# Altium project GatorSynth_Step_Sequencer.PrjPcb (part 2 of 2)

## Sheet Encoders.SchDoc
size Letter
Used 24 times, as channels AUX Encoders, AUX Encoders, AUX Encoders, AUX Encoders, AUX Encoders, AUX Encoders, AUX Encoders, AUX Encoders, NOTE Encoders, NOTE Encoders, NOTE Encoders, NOTE Encoders, NOTE Encoders, NOTE Encoders, NOTE Encoders, NOTE Encoders, NOTE Encoders, NOTE Encoders, NOTE Encoders, NOTE Encoders, NOTE Encoders, NOTE Encoders, NOTE Encoders, NOTE Encoders. Parts and nets are listed once, with the designators drawn on the sheet.
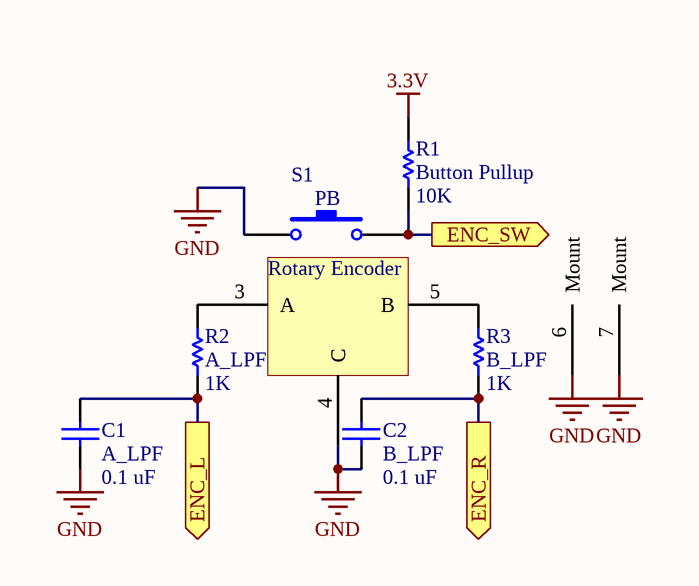
[diagram p10: Encoders.SchDoc]

### Parts
C1  A_LPF  value 0.1 uF  [C0805]
C2  B_LPF  value 0.1 uF  [C0805]
R1  Button Pullup  value 10K  [6-0805_N]
R2  A_LPF  value 1K  [6-0805_N]
R3  B_LPF  value 1K  [6-0805_N]
S1  Rotary Encoder  [Rotary Encoder SF]  (value not drawn)

### Ports
ENC_L (out), ENC_R (out), ENC_SW (out)

### Nets
3.3V: R1.1
GND: C1.1 C2.1 S1.1 S1.4(C) S1.6(Mount) S1.7(Mount)
ENC_L: C1.2 R2.2 ; port ENC_L
ENC_R: C2.2 R3.2 ; port ENC_R
ENC_SW: R1.2 S1.2 ; port ENC_SW
NetR2_1: R2.1 S1.3(A)
NetR3_1: R3.1 S1.5(B)

### Channels
AUX Encoders: designators end in _AUX_Encoders#1; ports ENC_L=AE_L0 ENC_R=AE_R0 ENC_SW=AE_SW0
AUX Encoders: designators end in _AUX_Encoders#2; ports ENC_L=AE_L1 ENC_R=AE_R1 ENC_SW=AE_SW1
AUX Encoders: designators end in _AUX_Encoders#3; ports ENC_L=AE_L2 ENC_R=AE_R2 ENC_SW=AE_SW2
AUX Encoders: designators end in _AUX_Encoders#4; ports ENC_L=AE_L3 ENC_R=AE_R3 ENC_SW=AE_SW3
AUX Encoders: designators end in _AUX_Encoders#5; ports ENC_L=AE_L4 ENC_R=AE_R4 ENC_SW=AE_SW4
AUX Encoders: designators end in _AUX_Encoders#6; ports ENC_L=AE_L5 ENC_R=AE_R5 ENC_SW=AE_SW5
AUX Encoders: designators end in _AUX_Encoders#7; ports ENC_L=AE_L6 ENC_R=AE_R6 ENC_SW=AE_SW6
AUX Encoders: designators end in _AUX_Encoders#8; ports ENC_L=AE_L7 ENC_R=AE_R7 ENC_SW=AE_SW7
NOTE Encoders: designators end in _NOTE_Encoders#1; ports ENC_L=NE_L0 ENC_R=NE_R0 ENC_SW=NE_SW0
NOTE Encoders: designators end in _NOTE_Encoders#2; ports ENC_L=NE_L1 ENC_R=NE_R1 ENC_SW=NE_SW1
NOTE Encoders: designators end in _NOTE_Encoders#3; ports ENC_L=NE_L2 ENC_R=NE_R2 ENC_SW=NE_SW2
NOTE Encoders: designators end in _NOTE_Encoders#4; ports ENC_L=NE_L3 ENC_R=NE_R3 ENC_SW=NE_SW3
NOTE Encoders: designators end in _NOTE_Encoders#5; ports ENC_L=NE_L4 ENC_R=NE_R4 ENC_SW=NE_SW4
NOTE Encoders: designators end in _NOTE_Encoders#6; ports ENC_L=NE_L5 ENC_R=NE_R5 ENC_SW=NE_SW5
NOTE Encoders: designators end in _NOTE_Encoders#7; ports ENC_L=NE_L6 ENC_R=NE_R6 ENC_SW=NE_SW6
NOTE Encoders: designators end in _NOTE_Encoders#8; ports ENC_L=NE_L7 ENC_R=NE_R7 ENC_SW=NE_SW7
NOTE Encoders: designators end in _NOTE_Encoders#9; ports ENC_L=NE_L8 ENC_R=NE_R8 ENC_SW=NE_SW8
NOTE Encoders: designators end in _NOTE_Encoders#10; ports ENC_L=NE_L9 ENC_R=NE_R9 ENC_SW=NE_SW9
NOTE Encoders: designators end in _NOTE_Encoders#11; ports ENC_L=NE_L10 ENC_R=NE_R10 ENC_SW=NE_SW10
NOTE Encoders: designators end in _NOTE_Encoders#12; ports ENC_L=NE_L11 ENC_R=NE_R11 ENC_SW=NE_SW11
NOTE Encoders: designators end in _NOTE_Encoders#13; ports ENC_L=NE_L12 ENC_R=NE_R12 ENC_SW=NE_SW12
NOTE Encoders: designators end in _NOTE_Encoders#14; ports ENC_L=NE_L13 ENC_R=NE_R13 ENC_SW=NE_SW13
NOTE Encoders: designators end in _NOTE_Encoders#15; ports ENC_L=NE_L14 ENC_R=NE_R14 ENC_SW=NE_SW14
NOTE Encoders: designators end in _NOTE_Encoders#16; ports ENC_L=NE_L15 ENC_R=NE_R15 ENC_SW=NE_SW15

### Notes on the sheet
- (in symbol Rotary Encoder) PB

### Library data of the parts
C1 C2 = Cap: Capacitor; Published: 8-Jun-2000; LatestRevisionDate: 17-Jul-2002; LatestRevisionNote: Re-released for DXP Platform.; PackageReference: RAD-0.3; Publisher: Altium Limited; PackageDescription: Radial Cap, Thru-Hole; 2 Leads; 0.3 in Pin Spacing
R1-R3 = Res1: Resistor; Published: 8-Jun-2000; LatestRevisionDate: 17-Jul-2002; LatestRevisionNote: Re-released for DXP Platform.; PackageReference: AXIAL-0.3; Publisher: Altium Limited; PackageDescription: Axial Device, Thru-Hole; 2 Leads; 0.3 in Pin Spacing

## Sheet Displays.SchDoc
size B
Used 8 times, as channels U_Displays, U_Displays, U_Displays, U_Displays, U_Displays, U_Displays, U_Displays, U_Displays. Parts and nets are listed once, with the designators drawn on the sheet.
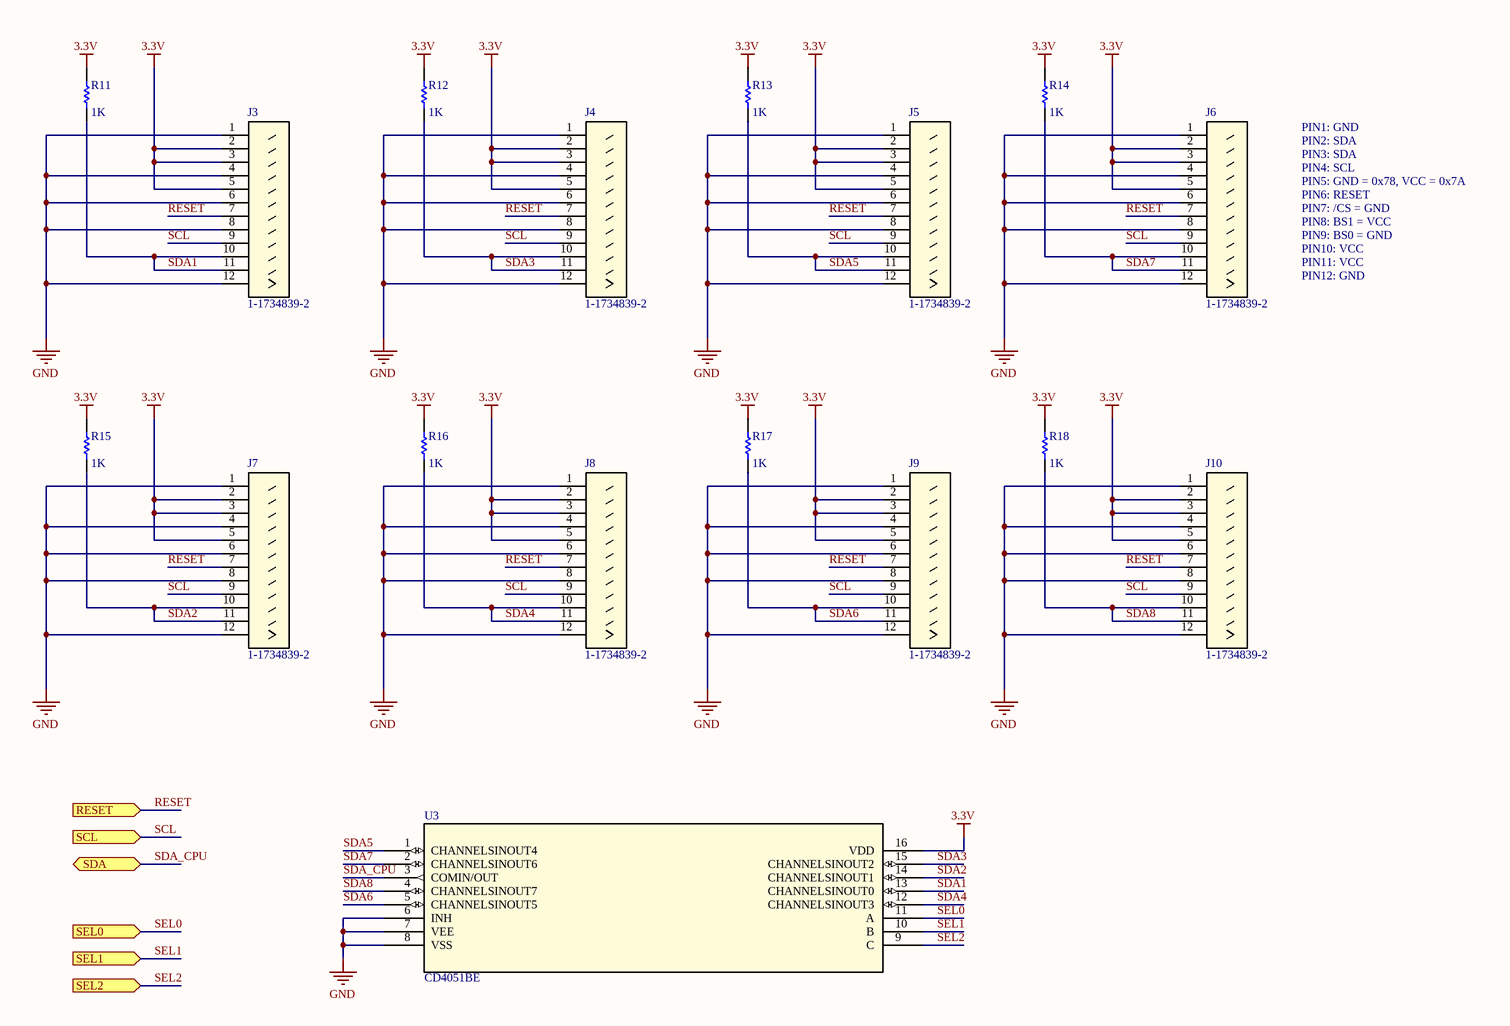
[diagram p11: Displays.SchDoc]

### Parts
J3  1-1734839-2  [CONN_1-1734592-2]
J4  1-1734839-2  [CONN_1-1734592-2]
J5  1-1734839-2  [CONN_1-1734592-2]
J6  1-1734839-2  [CONN_1-1734592-2]
J7  1-1734839-2  [CONN_1-1734592-2]
J8  1-1734839-2  [CONN_1-1734592-2]
J9  1-1734839-2  [CONN_1-1734592-2]
J10  1-1734839-2  [CONN_1-1734592-2]
R11  value 1K  [6-0805_N]
R12  value 1K  [6-0805_N]
R13  value 1K  [6-0805_N]
R14  value 1K  [6-0805_N]
R15  value 1K  [6-0805_N]
R16  value 1K  [6-0805_N]
R17  value 1K  [6-0805_N]
R18  value 1K  [6-0805_N]
U3  CD4051BE  [N16]

### Ports
RESET (in), SCL (in), SDA, SEL0 (in), SEL1 (in), SEL2 (in)

### Nets
3.3V: J3.2 J3.3 J3.5 J4.2 J4.3 J4.5 J5.2 J5.3 J5.5 J6.2 J6.3 J6.5 J7.2 J7.3 J7.5 J8.2 J8.3 J8.5 J9.2 J9.3 J9.5 J10.2 J10.3 J10.5 R11.1 R12.1 R13.1 R14.1 R15.1 R16.1 R17.1 R18.1 U3.16(VDD)
GND: J3.1 J3.4 J3.6 J3.8 J3.12 J4.1 J4.4 J4.6 J4.8 J4.12 J5.1 J5.4 J5.6 J5.8 J5.12 J6.1 J6.4 J6.6 J6.8 J6.12 J7.1 J7.4 J7.6 J7.8 J7.12 J8.1 J8.4 J8.6 J8.8 J8.12 J9.1 J9.4 J9.6 J9.8 J9.12 J10.1 J10.4 J10.6 J10.8 J10.12 U3.6(INH) U3.7(VEE) U3.8(VSS)
RESET: J3.7 J4.7 J5.7 J6.7 J7.7 J8.7 J9.7 J10.7 ; port RESET
SCL: J3.9 J4.9 J5.9 J6.9 J7.9 J8.9 J9.9 J10.9 ; port SCL
SDA1: J3.10 J3.11 R11.2 U3.13(CHANNELSINOUT0)
SDA2: J7.10 J7.11 R15.2 U3.14(CHANNELSINOUT1)
SDA3: J4.10 J4.11 R12.2 U3.15(CHANNELSINOUT2)
SDA4: J8.10 J8.11 R16.2 U3.12(CHANNELSINOUT3)
SDA5: J5.10 J5.11 R13.2 U3.1(CHANNELSINOUT4)
SDA6: J9.10 J9.11 R17.2 U3.5(CHANNELSINOUT5)
SDA7: J6.10 J6.11 R14.2 U3.2(CHANNELSINOUT6)
SDA8: J10.10 J10.11 R18.2 U3.4(CHANNELSINOUT7)
SDA_CPU: U3.3(COMIN/OUT) ; port SDA
SEL0: U3.11(A) ; port SEL0
SEL1: U3.10(B) ; port SEL1
SEL2: U3.9(C) ; port SEL2

### Channels
U_Displays: designators end in _U_Displays#1; ports RESET=DISP_RESET SCL=SCL SDA=SDA_CPU_U_Displays SEL0=SEL0_U_Displays SEL1=SEL1_U_Displays SEL2=SEL2_U_Displays
U_Displays: designators end in _U_Displays#2; ports RESET=DISP_RESET SCL=SCL SDA=SDA_CPU_U_Displays SEL0=SEL0_U_Displays SEL1=SEL1_U_Displays SEL2=SEL2_U_Displays
U_Displays: designators end in _U_Displays#3; ports RESET=DISP_RESET SCL=SCL SDA=SDA_CPU_U_Displays SEL0=SEL0_U_Displays SEL1=SEL1_U_Displays SEL2=SEL2_U_Displays
U_Displays: designators end in _U_Displays#4; ports RESET=DISP_RESET SCL=SCL SDA=SDA_CPU_U_Displays SEL0=SEL0_U_Displays SEL1=SEL1_U_Displays SEL2=SEL2_U_Displays
U_Displays: designators end in _U_Displays#5; ports RESET=DISP_RESET SCL=SCL SDA=SDA_CPU_U_Displays SEL0=SEL0_U_Displays SEL1=SEL1_U_Displays SEL2=SEL2_U_Displays
U_Displays: designators end in _U_Displays#6; ports RESET=DISP_RESET SCL=SCL SDA=SDA_CPU_U_Displays SEL0=SEL0_U_Displays SEL1=SEL1_U_Displays SEL2=SEL2_U_Displays
U_Displays: designators end in _U_Displays#7; ports RESET=DISP_RESET SCL=SCL SDA=SDA_CPU_U_Displays SEL0=SEL0_U_Displays SEL1=SEL1_U_Displays SEL2=SEL2_U_Displays
U_Displays: designators end in _U_Displays#8; ports RESET=DISP_RESET SCL=SCL SDA=SDA_CPU_U_Displays SEL0=SEL0_U_Displays SEL1=SEL1_U_Displays SEL2=SEL2_U_Displays

### Notes on the sheet
- PIN1: GND
- PIN2: SDA
- PIN3: SDA
- PIN4: SCL
- PIN5: GND = 0x78, VCC = 0x7A
- PIN7: /CS = GND
- PIN6: RESET
- PIN8: BS1 = VCC
- PIN9: BS0 = GND
- PIN10: VCC
- PIN11: VCC
- PIN12: GND

### Library data of the parts
J3-J10 = 1-1734839-2: Imported; Manufacturer_Name: Tyco Electronics Amp; Vendor: Tyco Electronics; Supersection: Connectors; Section: General Purpose; C: Copyright (C) 2015 Accelerated Designs. All rights reserved; Manufacturer_Part_Number: 1-1734839-2; Family: Headers and PCB Receptacles; Copyright: Copyright (C) 2015 Accelerated Designs. All rights reserved; RS_Part_Number: 7188674; Value: Value; Type: Type; RefDes: RefDes
R11-R18 = Res1: Resistor; Published: 8-Jun-2000; LatestRevisionDate: 17-Jul-2002; LatestRevisionNote: Re-released for DXP Platform.; PackageReference: AXIAL-0.3; Publisher: Altium Limited; PackageDescription: Axial Device, Thru-Hole; 2 Leads; 0.3 in Pin Spacing
U3 = CD4051BE: Imported; Vendor: Texas Instruments; Section: Switches and Multiplexers; C: Copyright (C) 2015 Accelerated Designs. All rights reserved; Manufacturer_Part_Number: CD4051BE; Family: Analogue Switch Multiplexer; Manufacturer_Name: Texas Instruments; Copyright: Copyright (C) 2015 Accelerated Designs. All rights reserved; RS_Part_Number: 5036098; Value: Value; Type: Type; RefDes: RefDes

## Sheet CV_Control.SchDoc
size Letter
Used 2 times, as channels CV Control, CV Control. Parts and nets are listed once, with the designators drawn on the sheet.
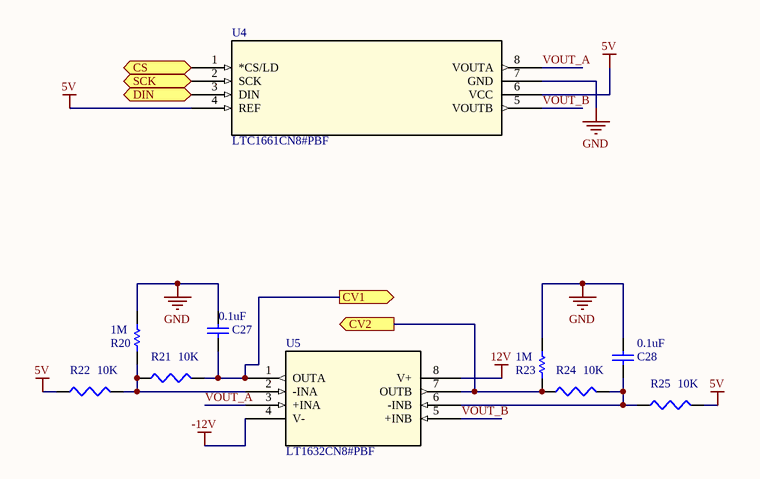
[diagram p12: CV_Control.SchDoc]

### Parts
C27  value 0.1uF  [RAD-0.3]  (hidden comment: Cap)
C28  value 0.1uF  [RAD-0.3]  (hidden comment: Cap)
R20  value 1M  [AXIAL-0.3]  (hidden comment: Res1)
R21  value 10K  [J1-0603]  (hidden comment: Res3)
R22  value 10K  [J1-0603]  (hidden comment: Res3)
R23  value 1M  [AXIAL-0.3]  (hidden comment: Res1)
R24  value 10K  [J1-0603]  (hidden comment: Res3)
R25  value 10K  [J1-0603]  (hidden comment: Res3)
U4  LTC1661CN8#PBF  [PDIP-8_N]
U5  LT1632CN8#PBF  [PDIP-8_N]

### Ports
CS (in), CV1 (out), CV2 (out), DIN, SCK

### Nets
5V: R22.1 R25.2 U4.4(REF) U4.6(VCC)
12V: U5.8(V+)
-12V: U5.4(V-)
GND: C27.2 C28.2 R20.2 R23.2 U4.7(GND)
CS: U4.1(*CS/LD) ; port CS
CV1: C27.1 R21.2 U5.1(OUTA) ; port CV1
CV2: R23.1 R24.1 U5.7(OUTB) ; port CV2
DIN: U4.3(DIN) ; port DIN
SCK: U4.2(SCK) ; port SCK
VOUT_A: U4.8(VOUTA) U5.3(+INA)
VOUT_B: U4.5(VOUTB) U5.5(+INB)
NetC28_1: C28.1 R24.2 R25.1 U5.6(-INB)
NetR20_1: R20.1 R21.1 R22.2 U5.2(-INA)

### Channels
CV Control: designators C27=C24_CV_Control2 C28=C25_CV_Control2 R20=R13_CV_Control2 R21=R14_CV_Control2 R22=R15_CV_Control2 R23=R16_CV_Control2 R24=R17_CV_Control2 R25=R18_CV_Control2 U4=U2_CV_Control2 U5=U3_CV_Control2; ports CS=CS1 CV1=CV1 CV2=CV2 DIN=MOSI SCK=SPCK
CV Control: designators C27=C24_CV_Control1 C28=C25_CV_Control1 R20=R13_CV_Control1 R21=R14_CV_Control1 R22=R15_CV_Control1 R23=R16_CV_Control1 R24=R17_CV_Control1 R25=R18_CV_Control1 U4=U2_CV_Control1 U5=U3_CV_Control1; ports CS=CS2 CV1=CV3 CV2=CV4 DIN=MOSI SCK=SPCK

### Library data of the parts
C27 C28 = Cap: Capacitor; Published: 8-Jun-2000; LatestRevisionDate: 17-Jul-2002; LatestRevisionNote: Re-released for DXP Platform.; PackageReference: RAD-0.3; Publisher: Altium Limited; PackageDescription: Radial Cap, Thru-Hole; 2 Leads; 0.3 in Pin Spacing
R20 R23 = Res1: Resistor; Published: 8-Jun-2000; LatestRevisionDate: 17-Jul-2002; LatestRevisionNote: Re-released for DXP Platform.; PackageReference: AXIAL-0.3; Publisher: Altium Limited; PackageDescription: Axial Device, Thru-Hole; 2 Leads; 0.3 in Pin Spacing
R21 R22 R24 R25 = Res3: Resistor; Published: 8-Jun-2000; LatestRevisionDate: 29-May-2009; LatestRevisionNote: IPC-7351 Footprint Added.; PackageReference: J1-0603; Publisher: Altium Limited; PackageDescription: Chip Resistor
U4 = LTC1661CN8#PBF: Imported; Vendor: Linear Technology; Manufacturer_Part_Number: LTC1661CN8#PBF; Value: Value; Type: Type; RefDes: RefDes
U5 = LT1632CN8#PBF: Imported; Operating_Temperature: 0Â°C ~ 70Â°C; Current_-_Output_/_Channel: 70mA; Voltage_-_Input_Offset: 500ÂµV; Current_-_Input_Bias: 1.15ÂµA; Output_Type: Rail-to-Rail; Vendor: Linear Technology; Amplifier_Type: General Purpose; Number_of_Circuits: 2; Slew_Rate: 45 V/Âµs; Gain_Bandwidth_Product: 45MHz; Current_-_Supply: 4.6mA; Current_-_Output/Channel: 40mA; Voltage_-_Supply,_Single/Dual_(Â±): 2.7 V ~ 36 V, Â±1.35 V ~ 18 V; Mounting_Type: Through Hole; 3D_Library_Name: Maxim2; C: Copyright (C) 2016 Accelerated Designs. All rights reserved; -3db_Bandwidth: -; Series: *; Manufacturer_Part_Number: LT1632CN8#PBF; DigiKeyPartNumber: LT1632CN8-ND; Quantity_Available: 0; DataSheet: http://www.linear.com/docs/3055; Packaging: Tube; Package_/_Case: 8-DIP (0.300", 7.62mm); Copyright: Copyright (C) 2015 Accelerated Designs. All rights reserved; Supplier_Device_Package: 8-PDIP; Value: Value; Type: Type; RefDes: RefDes

## Sheet Jack_Out.SchDoc
size Letter
Used 9 times, as channels Jack_Out, Jack_Out, Jack_Out, Jack_Out, Jack_Out, Jack_Out, Jack_Out, Jack_Out, Jack_Out. Parts and nets are listed once, with the designators drawn on the sheet.
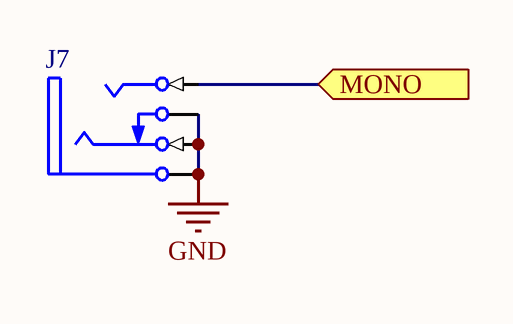
[diagram p13: Jack_Out.SchDoc]

### Parts
J7  Phonejack3 RN  [MHDR1X4]  (value not drawn)

### Ports
MONO (in)

### Nets
GND: J7.3(R) J7.4(RN) J7.5(S)
MONO: J7.1(T) ; port MONO

### Channels
Jack_Out: designators end in _Jack_Out9; ports MONO=CV4
Jack_Out: designators end in _Jack_Out8; ports MONO=GATE4
Jack_Out: designators end in _Jack_Out7; ports MONO=CV3
Jack_Out: designators end in _Jack_Out6; ports MONO=GATE3
Jack_Out: designators end in _Jack_Out5; ports MONO=CV2
Jack_Out: designators end in _Jack_Out4; ports MONO=GATE2
Jack_Out: designators end in _Jack_Out3; ports MONO=CV1
Jack_Out: designators end in _Jack_Out2; ports MONO=GATE1
Jack_Out: designators end in _Jack_Out1; ports MONO=CLK OUT

### Library data of the parts
J7 = Phonejack3 RN: Jack Socket, 1/4" [6.5mm], Thru-Hole, Vertical, 3-Conductor with Tip open & Ring closed; PackageDocument: 2003; PCB_Layout: Complies with manufacturer's recommendation.; DrillAndSlotSize: Corresponds to nominal value.; Published: 15-Jul-2004; DatasheetDocument: 2003; PackageReference: S1VS_SBS; Publisher: Altium Limited; ComponentLink1Description: Manufacturer Link; ComponentLink1URL: http://www.cliffuk.co.uk/

## Nets that join several sheets
3.3V: Top_Level (R4.2), Programmer (J4.1), Processor (12 pins), Buttons (16 pins), Digital_Io (U5.8), ButtonExpanders (8 pins), NoteExpanders (8 pins), Power (C28.1 L1.2 R33.1), AUX Encoders (R1_AUX_Encoders#1.1), AUX Encoders (R1_AUX_Encoders#2.1), AUX Encoders (R1_AUX_Encoders#3.1), AUX Encoders (R1_AUX_Encoders#4.1), AUX Encoders (R1_AUX_Encoders#5.1), AUX Encoders (R1_AUX_Encoders#6.1), AUX Encoders (R1_AUX_Encoders#7.1), AUX Encoders (R1_AUX_Encoders#8.1), NOTE Encoders (R1_NOTE_Encoders#1.1), NOTE Encoders (R1_NOTE_Encoders#2.1), NOTE Encoders (R1_NOTE_Encoders#3.1), NOTE Encoders (R1_NOTE_Encoders#4.1), NOTE Encoders (R1_NOTE_Encoders#5.1), NOTE Encoders (R1_NOTE_Encoders#6.1), NOTE Encoders (R1_NOTE_Encoders#7.1), NOTE Encoders (R1_NOTE_Encoders#8.1), NOTE Encoders (R1_NOTE_Encoders#9.1), NOTE Encoders (R1_NOTE_Encoders#10.1), NOTE Encoders (R1_NOTE_Encoders#11.1), NOTE Encoders (R1_NOTE_Encoders#12.1), NOTE Encoders (R1_NOTE_Encoders#13.1), NOTE Encoders (R1_NOTE_Encoders#14.1), NOTE Encoders (R1_NOTE_Encoders#15.1), NOTE Encoders (R1_NOTE_Encoders#16.1), U_Displays (33 pins), U_Displays (33 pins), U_Displays (33 pins), U_Displays (33 pins), U_Displays (33 pins), U_Displays (33 pins), U_Displays (33 pins), U_Displays (33 pins)
5V: Power (P9.5 P9.6), CV Control (R15_CV_Control2.1 R18_CV_Control2.2 U2_CV_Control2.4 U2_CV_Control2.6), CV Control (R15_CV_Control1.1 R18_CV_Control1.2 U2_CV_Control1.4 U2_CV_Control1.6)
12V: Gate Control (U4_Gate_Control2.8), Buttons (16 pins), Digital_Io (U6.8), Power (5 pins), Gate Control (U4_Gate_Control1.8), CV Control (U3_CV_Control2.8), CV Control (U3_CV_Control1.8)
-12V: Gate Control (U4_Gate_Control2.4), Digital_Io (U6.4), Power (P9.15 P9.16), Gate Control (U4_Gate_Control1.4), CV Control (U3_CV_Control2.4), CV Control (U3_CV_Control1.4)
GND: Top_Level (5 pins), Programmer (J4.3 J4.5 J4.9), Gate Control (R20_Gate_Control2.1 R22_Gate_Control2.2), Processor (17 pins), Buttons (38 pins), Jack_In (J6.3 J6.5), Digital_Io (8 pins), ButtonExpanders (C23_ButtonExpanders.2 EXP1_ButtonExpanders.3 EXP1_ButtonExpanders.12), NoteExpanders (C23_NoteExpanders.2 EXP1_NoteExpanders.3 EXP1_NoteExpanders.12), Power (10 pins), AUX Encoders (6 pins), AUX Encoders (6 pins), AUX Encoders (6 pins), AUX Encoders (6 pins), AUX Encoders (6 pins), AUX Encoders (6 pins), AUX Encoders (6 pins), AUX Encoders (6 pins), NOTE Encoders (6 pins), NOTE Encoders (6 pins), NOTE Encoders (6 pins), NOTE Encoders (6 pins), NOTE Encoders (6 pins), NOTE Encoders (6 pins), NOTE Encoders (6 pins), NOTE Encoders (6 pins), NOTE Encoders (6 pins), NOTE Encoders (6 pins), NOTE Encoders (6 pins), NOTE Encoders (6 pins), NOTE Encoders (6 pins), NOTE Encoders (6 pins), NOTE Encoders (6 pins), NOTE Encoders (6 pins), U_Displays (43 pins), U_Displays (43 pins), U_Displays (43 pins), U_Displays (43 pins), U_Displays (43 pins), U_Displays (43 pins), U_Displays (43 pins), U_Displays (43 pins), Gate Control (R20_Gate_Control1.1 R22_Gate_Control1.2), CV Control (5 pins), CV Control (5 pins), Jack_Out (J7_Jack_Out9.3 J7_Jack_Out9.4 J7_Jack_Out9.5), Jack_Out (J7_Jack_Out8.3 J7_Jack_Out8.4 J7_Jack_Out8.5), Jack_Out (J7_Jack_Out7.3 J7_Jack_Out7.4 J7_Jack_Out7.5), Jack_Out (J7_Jack_Out6.3 J7_Jack_Out6.4 J7_Jack_Out6.5), Jack_Out (J7_Jack_Out5.3 J7_Jack_Out5.4 J7_Jack_Out5.5), Jack_Out (J7_Jack_Out4.3 J7_Jack_Out4.4 J7_Jack_Out4.5), Jack_Out (J7_Jack_Out3.3 J7_Jack_Out3.4 J7_Jack_Out3.5), Jack_Out (J7_Jack_Out2.3 J7_Jack_Out2.4 J7_Jack_Out2.5), Jack_Out (J7_Jack_Out1.3 J7_Jack_Out1.4 J7_Jack_Out1.5)
VCC: Top_Level (R25#1.2), Buttons (R10.2), Jack_In (R31.2), Digital_Io (R25#2.2)
AE_L0: Processor (U1.74), AUX Encoders (C1_AUX_Encoders#1.2 R2_AUX_Encoders#1.2)
AE_L1: Processor (U1.52), AUX Encoders (C1_AUX_Encoders#2.2 R2_AUX_Encoders#2.2)
AE_L2: Processor (U1.48), AUX Encoders (C1_AUX_Encoders#3.2 R2_AUX_Encoders#3.2)
AE_L3: Processor (U1.28), AUX Encoders (C1_AUX_Encoders#4.2 R2_AUX_Encoders#4.2)
AE_L4: Processor (U1.24), AUX Encoders (C1_AUX_Encoders#5.2 R2_AUX_Encoders#5.2)
AE_L5: Processor (U1.20), AUX Encoders (C1_AUX_Encoders#6.2 R2_AUX_Encoders#6.2)
AE_L6: Processor (U1.34), AUX Encoders (C1_AUX_Encoders#7.2 R2_AUX_Encoders#7.2)
AE_L7: Processor (U1.39), AUX Encoders (C1_AUX_Encoders#8.2 R2_AUX_Encoders#8.2)
AE_R0: Processor (U1.72), AUX Encoders (C2_AUX_Encoders#1.2 R3_AUX_Encoders#1.2)
AE_R1: Processor (U1.49), AUX Encoders (C2_AUX_Encoders#2.2 R3_AUX_Encoders#2.2)
AE_R2: Processor (U1.46), AUX Encoders (C2_AUX_Encoders#3.2 R3_AUX_Encoders#3.2)
AE_R3: Processor (U1.12), AUX Encoders (C2_AUX_Encoders#4.2 R3_AUX_Encoders#4.2)
AE_R4: Processor (U1.15), AUX Encoders (C2_AUX_Encoders#5.2 R3_AUX_Encoders#5.2)
AE_R5: Processor (U1.22), AUX Encoders (C2_AUX_Encoders#6.2 R3_AUX_Encoders#6.2)
AE_R6: Processor (U1.38), AUX Encoders (C2_AUX_Encoders#7.2 R3_AUX_Encoders#7.2)
AE_R7: Processor (U1.57), AUX Encoders (C2_AUX_Encoders#8.2 R3_AUX_Encoders#8.2)
AE_SW0: NoteExpanders (EXP1_NoteExpanders.13 R12_NoteExpanders.6), AUX Encoders (R1_AUX_Encoders#1.2 S1_AUX_Encoders#1.2)
AE_SW1: NoteExpanders (EXP1_NoteExpanders.14 R12_NoteExpanders.7), AUX Encoders (R1_AUX_Encoders#2.2 S1_AUX_Encoders#2.2)
AE_SW2: NoteExpanders (EXP1_NoteExpanders.15 R12_NoteExpanders.8), AUX Encoders (R1_AUX_Encoders#3.2 S1_AUX_Encoders#3.2)
AE_SW3: NoteExpanders (EXP1_NoteExpanders.16 R12_NoteExpanders.9), AUX Encoders (R1_AUX_Encoders#4.2 S1_AUX_Encoders#4.2)
AE_SW4: NoteExpanders (EXP1_NoteExpanders.17 R12_NoteExpanders.4), AUX Encoders (R1_AUX_Encoders#5.2 S1_AUX_Encoders#5.2)
AE_SW5: NoteExpanders (EXP1_NoteExpanders.18 R12_NoteExpanders.3), AUX Encoders (R1_AUX_Encoders#6.2 S1_AUX_Encoders#6.2)
AE_SW6: NoteExpanders (EXP1_NoteExpanders.19 R12_NoteExpanders.2), AUX Encoders (R1_AUX_Encoders#7.2 S1_AUX_Encoders#7.2)
AE_SW7: NoteExpanders (EXP1_NoteExpanders.20 R12_NoteExpanders.1), AUX Encoders (R1_AUX_Encoders#8.2 S1_AUX_Encoders#8.2)
BPM_IN: Jack_In (J6.1), Digital_Io (U5.3)
BPM_OUT: Processor (U1.41), Digital_Io (U6.3)
BPM_TRIG: Processor (U1.53), Digital_Io (C26.1 D1.2 R23.2 U5.1)
BTN_INT: Processor (U1.88), ButtonExpanders (EXP1_ButtonExpanders.1 R10_ButtonExpanders.1)
CLK OUT: Digital_Io (R27.2 U6.1), Jack_Out (J7_Jack_Out1.1)
CS1: Processor (U1.93), CV Control (U2_CV_Control2.1)
CS2: Processor (U1.99), CV Control (U2_CV_Control1.1)
CV1: CV Control (C24_CV_Control2.1 R14_CV_Control2.2 U3_CV_Control2.1), Jack_Out (J7_Jack_Out3.1)
CV2: CV Control (R16_CV_Control2.1 R17_CV_Control2.1 U3_CV_Control2.7), Jack_Out (J7_Jack_Out5.1)
CV3: CV Control (C24_CV_Control1.1 R14_CV_Control1.2 U3_CV_Control1.1), Jack_Out (J7_Jack_Out7.1)
CV4: CV Control (R16_CV_Control1.1 R17_CV_Control1.1 U3_CV_Control1.7), Jack_Out (J7_Jack_Out9.1)
DISP_RESET: Processor (U1.81), U_Displays (8 pins), U_Displays (8 pins), U_Displays (8 pins), U_Displays (8 pins), U_Displays (8 pins), U_Displays (8 pins), U_Displays (8 pins), U_Displays (8 pins)
ENC_INT: Processor (U1.89), NoteExpanders (EXP1_NoteExpanders.1 R10_NoteExpanders.1)
GATE1: Gate Control (R19_Gate_Control1.2 U4_Gate_Control1.1), Jack_Out (J7_Jack_Out2.1)
GATE2: Gate Control (R21_Gate_Control1.1 U4_Gate_Control1.7), Jack_Out (J7_Jack_Out4.1)
GATE3: Gate Control (R21_Gate_Control2.1 U4_Gate_Control2.7), Jack_Out (J7_Jack_Out6.1)
GATE4: Gate Control (R19_Gate_Control2.2 U4_Gate_Control2.1), Jack_Out (J7_Jack_Out8.1)
GATE_OUT1: Processor (U1.3), Gate Control (U4_Gate_Control1.3)
GATE_OUT2: Processor (U1.5), Gate Control (U4_Gate_Control1.5)
GATE_OUT3: Gate Control (U4_Gate_Control2.3), Processor (U1.7)
GATE_OUT4: Gate Control (U4_Gate_Control2.5), Processor (U1.9)
JACK_INT: Processor (U1.44), Jack_In (J6.4 R31.1)
MOSI: Processor (U1.33), Buttons (DRV1.9), CV Control (U2_CV_Control2.3), CV Control (U2_CV_Control1.3)
NE_L0: Processor (U1.25), NOTE Encoders (C1_NOTE_Encoders#1.2 R2_NOTE_Encoders#1.2)
NE_L1: Processor (U1.43), NOTE Encoders (C1_NOTE_Encoders#2.2 R2_NOTE_Encoders#2.2)
NE_L2: Processor (U1.37), NOTE Encoders (C1_NOTE_Encoders#3.2 R2_NOTE_Encoders#3.2)
NE_L3: Processor (U1.32), NOTE Encoders (C1_NOTE_Encoders#4.2 R2_NOTE_Encoders#4.2)
NE_L4: Processor (U1.58), NOTE Encoders (C1_NOTE_Encoders#5.2 R2_NOTE_Encoders#5.2)
NE_L5: Processor (U1.65), NOTE Encoders (C1_NOTE_Encoders#6.2 R2_NOTE_Encoders#6.2)
NE_L6: Processor (U1.23), NOTE Encoders (C1_NOTE_Encoders#7.2 R2_NOTE_Encoders#7.2)
NE_L7: Processor (U1.71), NOTE Encoders (C1_NOTE_Encoders#8.2 R2_NOTE_Encoders#8.2)
NE_L8: Processor (U1.73), NOTE Encoders (C1_NOTE_Encoders#9.2 R2_NOTE_Encoders#9.2)
NE_L9: Processor (U1.78), NOTE Encoders (C1_NOTE_Encoders#10.2 R2_NOTE_Encoders#10.2)
NE_L10: Processor (U1.82), NOTE Encoders (C1_NOTE_Encoders#11.2 R2_NOTE_Encoders#11.2)
NE_L11: Processor (U1.86), NOTE Encoders (C1_NOTE_Encoders#12.2 R2_NOTE_Encoders#12.2)
NE_L12: Processor (U1.92), NOTE Encoders (C1_NOTE_Encoders#13.2 R2_NOTE_Encoders#13.2)
NE_L13: Processor (U1.13), NOTE Encoders (C1_NOTE_Encoders#14.2 R2_NOTE_Encoders#14.2)
NE_L14: Processor (U1.54), NOTE Encoders (C1_NOTE_Encoders#15.2 R2_NOTE_Encoders#15.2)
NE_L15: Processor (U1.6), NOTE Encoders (C1_NOTE_Encoders#16.2 R2_NOTE_Encoders#16.2)
NE_R0: Processor (U1.47), NOTE Encoders (C2_NOTE_Encoders#1.2 R3_NOTE_Encoders#1.2)
NE_R1: Processor (U1.40), NOTE Encoders (C2_NOTE_Encoders#2.2 R3_NOTE_Encoders#2.2)
NE_R2: Processor (U1.35), NOTE Encoders (C2_NOTE_Encoders#3.2 R3_NOTE_Encoders#3.2)
NE_R3: Processor (U1.29), NOTE Encoders (C2_NOTE_Encoders#4.2 R3_NOTE_Encoders#4.2)
NE_R4: Processor (U1.62), NOTE Encoders (C2_NOTE_Encoders#5.2 R3_NOTE_Encoders#5.2)
NE_R5: Processor (U1.68), NOTE Encoders (C2_NOTE_Encoders#6.2 R3_NOTE_Encoders#6.2)
NE_R6: Processor (U1.21), NOTE Encoders (C2_NOTE_Encoders#7.2 R3_NOTE_Encoders#7.2)
NE_R7: Processor (U1.19), NOTE Encoders (C2_NOTE_Encoders#8.2 R3_NOTE_Encoders#8.2)
NE_R8: Processor (U1.75), NOTE Encoders (C2_NOTE_Encoders#9.2 R3_NOTE_Encoders#9.2)
NE_R9: Processor (U1.80), NOTE Encoders (C2_NOTE_Encoders#10.2 R3_NOTE_Encoders#10.2)
NE_R10: Processor (U1.84), NOTE Encoders (C2_NOTE_Encoders#11.2 R3_NOTE_Encoders#11.2)
NE_R11: Processor (U1.90), NOTE Encoders (C2_NOTE_Encoders#12.2 R3_NOTE_Encoders#12.2)
NE_R12: Processor (U1.94), NOTE Encoders (C2_NOTE_Encoders#13.2 R3_NOTE_Encoders#13.2)
NE_R13: Processor (U1.17), NOTE Encoders (C2_NOTE_Encoders#14.2 R3_NOTE_Encoders#14.2)
NE_R14: Processor (U1.4), NOTE Encoders (C2_NOTE_Encoders#15.2 R3_NOTE_Encoders#15.2)
NE_R15: Processor (U1.8), NOTE Encoders (C2_NOTE_Encoders#16.2 R3_NOTE_Encoders#16.2)
NE_SW0: NoteExpanders (EXP1_NoteExpanders.4 R11_NoteExpanders.1), NOTE Encoders (R1_NOTE_Encoders#1.2 S1_NOTE_Encoders#1.2)
NE_SW1: NoteExpanders (EXP1_NoteExpanders.5 R11_NoteExpanders.2), NOTE Encoders (R1_NOTE_Encoders#2.2 S1_NOTE_Encoders#2.2)
NE_SW2: NoteExpanders (EXP1_NoteExpanders.6 R11_NoteExpanders.3), NOTE Encoders (R1_NOTE_Encoders#3.2 S1_NOTE_Encoders#3.2)
NE_SW3: NoteExpanders (EXP1_NoteExpanders.7 R11_NoteExpanders.4), NOTE Encoders (R1_NOTE_Encoders#4.2 S1_NOTE_Encoders#4.2)
NE_SW4: NoteExpanders (EXP1_NoteExpanders.8 R11_NoteExpanders.9), NOTE Encoders (R1_NOTE_Encoders#5.2 S1_NOTE_Encoders#5.2)
NE_SW5: NoteExpanders (EXP1_NoteExpanders.9 R11_NoteExpanders.8), NOTE Encoders (R1_NOTE_Encoders#6.2 S1_NOTE_Encoders#6.2)
NE_SW6: NoteExpanders (EXP1_NoteExpanders.10 R11_NoteExpanders.7), NOTE Encoders (R1_NOTE_Encoders#7.2 S1_NOTE_Encoders#7.2)
NE_SW7: NoteExpanders (EXP1_NoteExpanders.11 R11_NoteExpanders.6), NOTE Encoders (R1_NOTE_Encoders#8.2 S1_NOTE_Encoders#8.2)
NetJ4_2: Programmer (J4.2), Processor (U1.79)
NetJ4_4: Programmer (J4.4), Processor (U1.83)
NetJ4_6: Programmer (J4.6), Processor (U1.76)
NetJ4_8: Programmer (J4.8), Processor (U1.51)
NetJ4_10: Programmer (J4.10), Processor (U1.60)
NetR4_3: Top_Level (R4.3), Processor (U1.18)
PLAY/PAUSE_LED: Processor (U1.14), Digital_Io (U6.5)
PP_BTN: Top_Level (P8#1.SIG2 R25#1.1), Processor (U1.67)
SCL: Processor (U1.55), ButtonExpanders (EXP1_ButtonExpanders.22), NoteExpanders (EXP1_NoteExpanders.22), U_Displays (8 pins), U_Displays (8 pins), U_Displays (8 pins), U_Displays (8 pins), U_Displays (8 pins), U_Displays (8 pins), U_Displays (8 pins), U_Displays (8 pins)
SDA: Processor (U1.66), ButtonExpanders (EXP1_ButtonExpanders.23), NoteExpanders (EXP1_NoteExpanders.23)
SPCK: Processor (U1.31), Buttons (DRV1.10), CV Control (U2_CV_Control2.2), CV Control (U2_CV_Control1.2)
SW1: Buttons (P1.SIG2), ButtonExpanders (EXP1_ButtonExpanders.4 R11_ButtonExpanders.1)
SW2: Buttons (P1.SIG4), ButtonExpanders (EXP1_ButtonExpanders.5 R11_ButtonExpanders.2)
SW3: Buttons (P2.SIG2), ButtonExpanders (EXP1_ButtonExpanders.6 R11_ButtonExpanders.3)
SW4: Buttons (P2.SIG4), ButtonExpanders (EXP1_ButtonExpanders.7 R11_ButtonExpanders.4)
SW5: Buttons (P3.SIG2), ButtonExpanders (EXP1_ButtonExpanders.8 R11_ButtonExpanders.9)
SW6: Buttons (P3.SIG4), ButtonExpanders (EXP1_ButtonExpanders.9 R11_ButtonExpanders.8)
SW7: Buttons (P4.SIG2), ButtonExpanders (EXP1_ButtonExpanders.10 R11_ButtonExpanders.7)
SW8: Buttons (P4.SIG4), ButtonExpanders (EXP1_ButtonExpanders.11 R11_ButtonExpanders.6)
SW9: Buttons (P1.SIG6), ButtonExpanders (EXP1_ButtonExpanders.13 R12_ButtonExpanders.6)
SW10: Buttons (P1.SIG8), ButtonExpanders (EXP1_ButtonExpanders.14 R12_ButtonExpanders.7)
SW11: Buttons (P2.SIG6), ButtonExpanders (EXP1_ButtonExpanders.15 R12_ButtonExpanders.8)
SW12: Buttons (P2.SIG8), ButtonExpanders (EXP1_ButtonExpanders.16 R12_ButtonExpanders.9)
SW13: Buttons (P3.SIG6), ButtonExpanders (EXP1_ButtonExpanders.17 R12_ButtonExpanders.4)
SW14: Buttons (P3.SIG8), ButtonExpanders (EXP1_ButtonExpanders.18 R12_ButtonExpanders.3)
SW15: Buttons (P4.SIG6), ButtonExpanders (EXP1_ButtonExpanders.19 R12_ButtonExpanders.2)
SW16: Buttons (P4.SIG8), ButtonExpanders (EXP1_ButtonExpanders.20 R12_ButtonExpanders.1)